# EAGLE schematic THESIS1 (EAGLE 9.2.2)
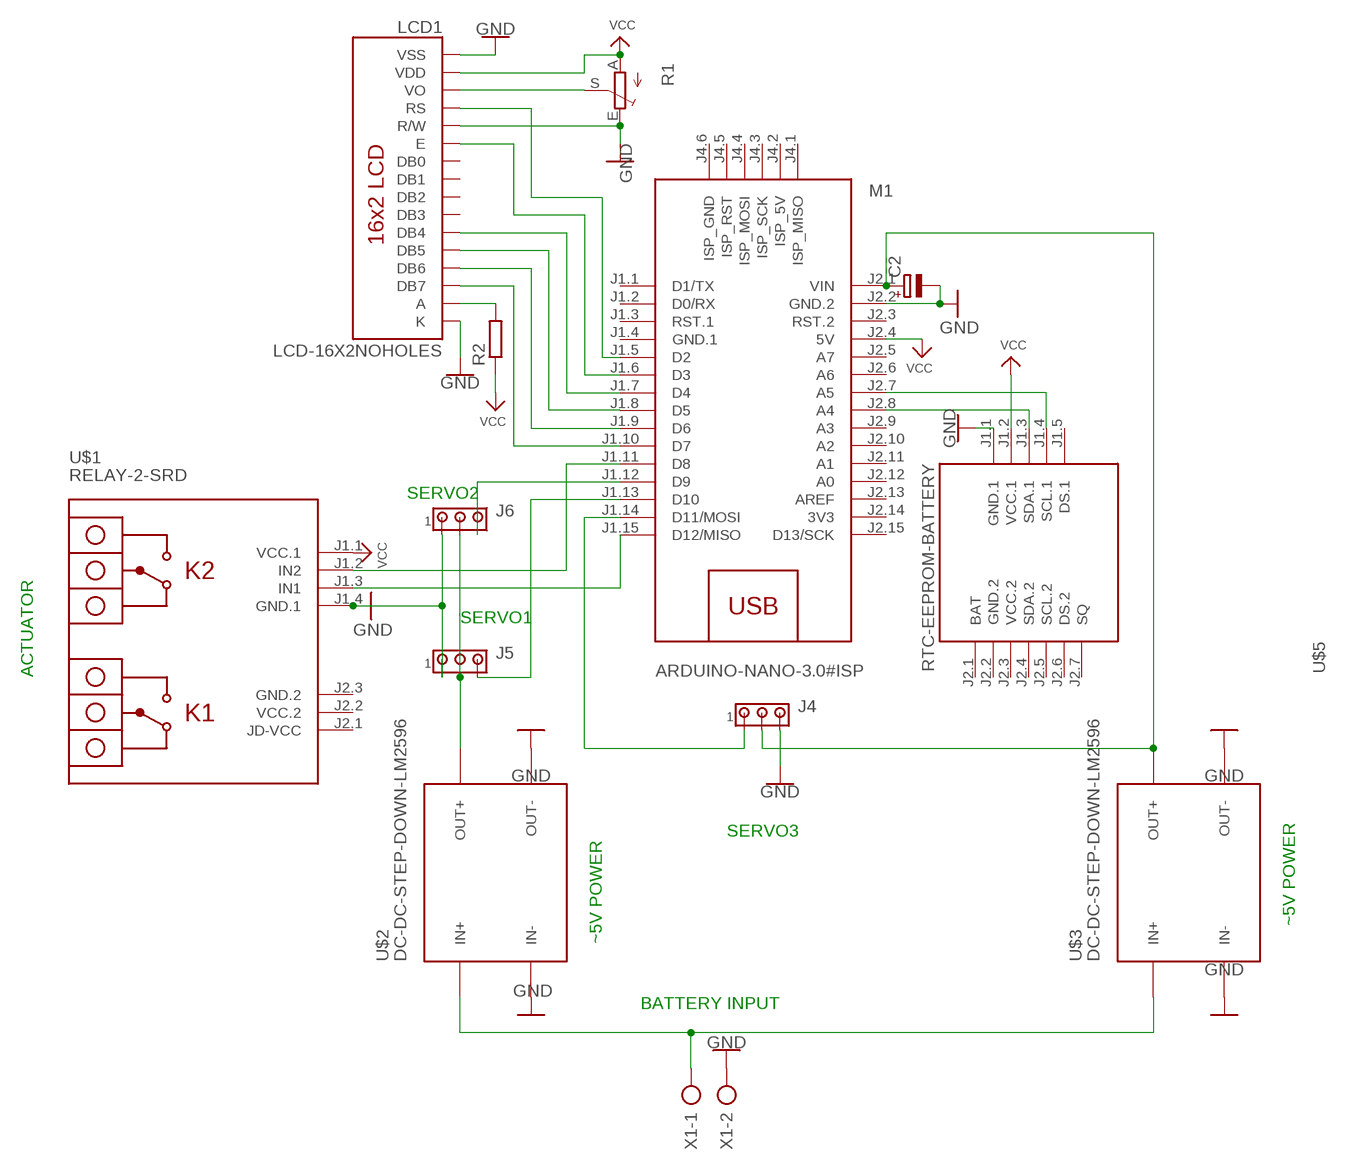
[diagram p0: schematic, sheet 1]

## Parts
C2  CPOL-EUE1.8-4  [E1,8-4]
J4  MTA03-100  [10X03MTA]
J5  MTA03-100  [10X03MTA]
J6  MTA03-100  [10X03MTA]
LCD1  LCD-16X2NOHOLES  [LCD-16X2_NOHOLESNOSILK]
M1  ARDUINO-NANO-3.0#ISP  [ARDUINO-NANO-3.0#ISP]
R1  TRIM_EU-CIP20C-6MM  [CIP20C-6MM]
R2  R-EU_0204/7  [0204/7]
U$1  RELAY-2-SRD  [RELAY-2-SRD]
U$2  DC-DC-STEP-DOWN-LM2596  [DC-DC-STEP-DOWN-LM2596]
U$3  DC-DC-STEP-DOWN-LM2596  [DC-DC-STEP-DOWN-LM2596]
U$5  RTC-EEPROM-BATTERY  [RTC-EEPROM-BATTERY]
X1  AK300/2  [AK300/2]

## Nets
GND: C2.- J4.3 J5.1 J6.1 LCD1.1(VSS) LCD1.5(R/W) LCD1.16(K) M1.J2.2(GND.2) R1.E U$1.J1.4(GND.1) U$2.IN- U$2.OUT- U$3.IN- U$3.OUT- U$5.J1.1(GND.1) X1.2
N$1: U$2.IN+ U$3.IN+ X1.1
N$2: LCD1.14(DB7) M1.J1.10(D7)
N$3: LCD1.13(DB6) M1.J1.9(D6)
N$4: LCD1.12(DB5) M1.J1.8(D5)
N$5: LCD1.3(VO) R1.S
N$6: LCD1.11(DB4) M1.J1.7(D4)
N$7: LCD1.15(A) R2.2
N$8: C2.+ J4.2 M1.J2.1(VIN) U$3.OUT+
N$9: LCD1.4(RS) M1.J1.5(D2)
N$10: LCD1.6(E) M1.J1.6(D3)
N$11: M1.J2.8(A4) U$5.J1.3(SDA.1)
N$12: M1.J2.7(A5) U$5.J1.4(SCL.1)
N$13: J4.1 M1.J1.14(D11/MOSI)
N$15: J5.2 J6.2 U$2.OUT+
N$16: J6.3 M1.J1.12(D9)
N$17: M1.J1.15(D12/MISO) U$1.J1.3(IN1)
N$18: M1.J1.11(D8) U$1.J1.2(IN2)
N$19: J5.3 M1.J1.13(D10)
VCC: LCD1.2(VDD) M1.J2.4(5V) R1.A R2.1 U$1.J1.1(VCC.1) U$5.J1.2(VCC.1)
Unconnected: LCD1.7(DB0) LCD1.8(DB1) LCD1.9(DB2) LCD1.10(DB3) M1.J1.1(D1/TX) M1.J1.2(D0/RX) M1.J1.3(RST.1) M1.J2.3(RST.2) M1.J2.5(A7) M1.J2.6(A6) M1.J2.9(A3) M1.J2.10(A2) M1.J2.11(A1) M1.J2.12(A0) M1.J2.13(AREF) M1.J2.15(D13/SCK) M1.J4.1(ISP_MISO) M1.J4.2(ISP_5V) M1.J4.3(ISP_SCK) M1.J4.4(ISP_MOSI) M1.J4.5(ISP_RST) M1.J4.6(ISP_GND) U$1.J2.1(JD-VCC) U$5.J1.5(DS.1) U$5.J2.1(BAT) U$5.J2.4(SDA.2) U$5.J2.5(SCL.2) U$5.J2.6(DS.2) U$5.J2.7(SQ)

## Notes on the sheet
- SERVO2
- SERVO1
- ACTUATOR
- SERVO3
- ~5V POWER
- ~5V POWER
- BATTERY INPUT

## Power pins joined to a net without a drawn wire
3V3: M1.J2.14(3V3)
GND.1: M1.J1.4(GND.1)
GND.2: U$1.J2.3(GND.2) U$5.J2.2(GND.2)
VCC.2: U$1.J2.2(VCC.2) U$5.J2.3(VCC.2)

## Library data of the parts
C2 = rcl:CPOL-EU: POLARIZED CAPACITOR, European symbol; SPICEPREFIX: C
J4-J6 = con-amp:MTA03-100: AMP connector
LCD1 = SparkFun-Displays:LCD-16X2: Standard text-only 16x2 parallel input LCD Basic 16 character by 2 line display. Typically utilizes the extremely common HD44780 parallel interface chipset SparkFun Products: Basic 16x2 Green <https://www.sparkfun.com/products/255> Basic 8x2 Green <https://www.sparkfun.com/products/11122>; SF_ID: LCD-00255
M1 = diy-modules step down:ARDUINO-NANO-3.0#ISP: Arduino Nano 3.0 (and compatible devices) with ISP pads More details available here: https://www.arduino.cc/en/Main/ArduinoBoardNano Click here to find device on ebay.com <http://www.ebay.com/sch/arduino+nano>
R1 = pot:TRIM_EU-: POTENTIOMETER
R2 = rcl:R-EU_: RESISTOR, European symbol; SPICEPREFIX: R
U$1 = diy-modules:RELAY-2-SRD: 2-Channel Relay Module based on SRD-05VDC-SL-C relays Click here to find device on ebay.com <http://www.ebay.com/sch/two+channel+relay+module+optocoupler+5v>
U$2 U$3 = diy-modules:DC-DC-STEP-DOWN-LM2596: DC/DC Step-Down Regulator based on LM2596-ADJ chip LM2596 datasheet available here: http://www.ti.com/lit/ds/symlink/lm2596.pdf Click here to find device on ebay.com <http://www.ebay.com/sch/lm2596+power+regulator>
U$5 = diy-modules:RTC-EEPROM-BATTERY: RTC Module with Battery and EEPROM based on DS1307 and AT24C32 chips More details available here: http://henrysbench.capnfatz.com/henrys-bench/arduino-sensors-and-input/arduino-tiny-rtc-d1307-tutorial/ Click here to find device on ebay.com <http://www.ebay.com/sch/tiny+rtc+arduino>
X1 = con-ptr500:AK300/2: CONNECTOR; OC_FARNELL: unknown; OC_NEWARK: unknown